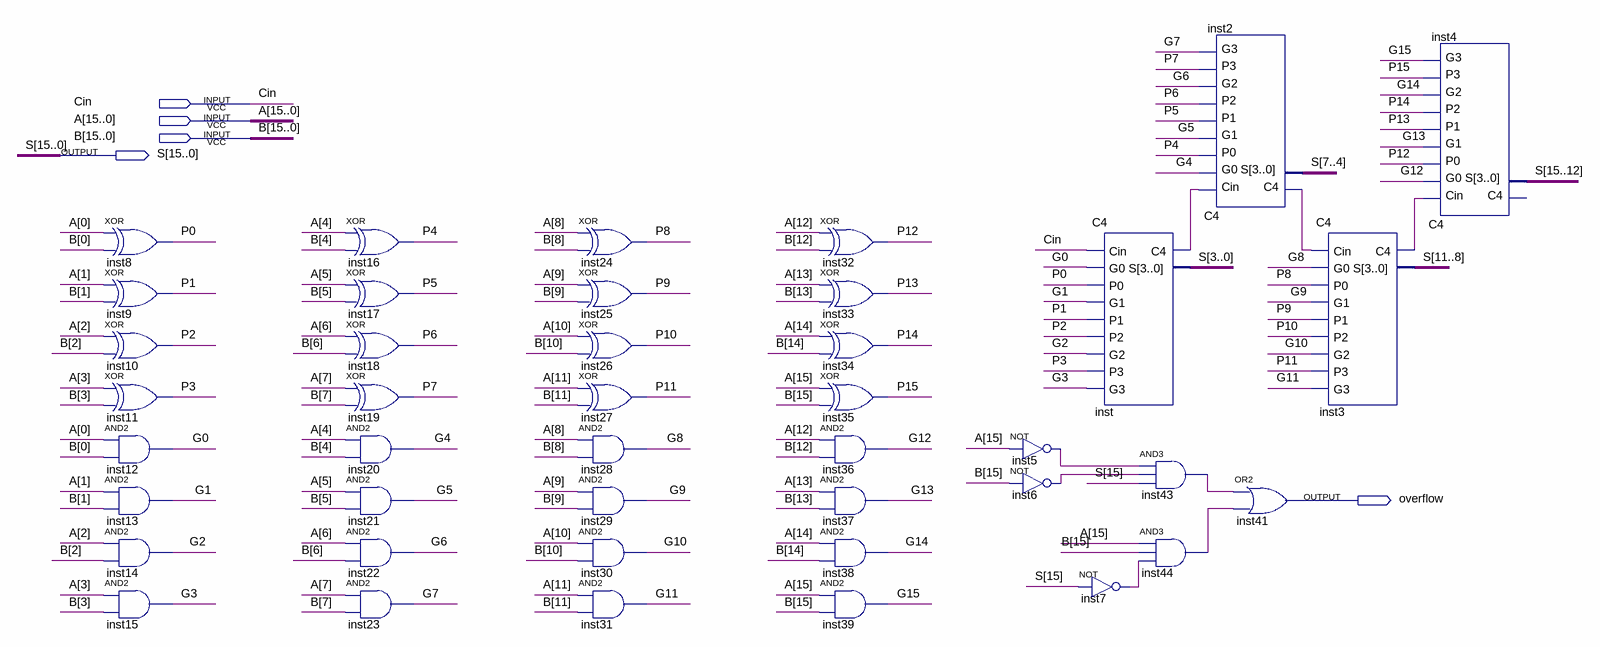
[diagram p0: schematic sheet]
// Quartus schematic CLHA.bdf as structural Verilog: 42 symbols, 5 pins
module CLHA (
  input  Cin,
  input  [15:0] A,
  input  [15:0] B,
  output [15:0] S,
  output overflow
);

  wire G0, G1, G2, G3, G4, G5, G6, G7, G8, G9, G10, G11, G12, G13, G14, G15, inst2_c4, inst3_c4, inst5_out,
       inst6_out, inst7_out, inst43_out, inst44_out, inst_c4, P0, P1, P2, P3, P4, P5, P6, P7, P8, P9, P10,
       P11, P12, P13, P14, P15;

  xor inst8 (P0, A[0], B[0]);
  xor inst9 (P1, A[1], B[1]);
  xor inst10 (P2, A[2], B[2]);
  xor inst11 (P3, A[3], B[3]);
  and inst12 (G0, A[0], B[0]);
  and inst13 (G1, A[1], B[1]);
  and inst14 (G2, A[2], B[2]);
  and inst15 (G3, A[3], B[3]);
  xor inst16 (P4, A[4], B[4]);
  xor inst17 (P5, A[5], B[5]);
  xor inst18 (P6, A[6], B[6]);
  xor inst19 (P7, A[7], B[7]);
  and inst20 (G4, A[4], B[4]);
  and inst21 (G5, A[5], B[5]);
  and inst22 (G6, A[6], B[6]);
  and inst23 (G7, A[7], B[7]);
  xor inst24 (P8, A[8], B[8]);
  xor inst25 (P9, A[9], B[9]);
  xor inst26 (P10, A[10], B[10]);
  xor inst27 (P11, A[11], B[11]);
  and inst28 (G8, A[8], B[8]);
  and inst29 (G9, A[9], B[9]);
  and inst30 (G10, A[10], B[10]);
  and inst31 (G11, A[11], B[11]);
  xor inst32 (P12, A[12], B[12]);
  xor inst33 (P13, A[13], B[13]);
  xor inst34 (P14, A[14], B[14]);
  xor inst35 (P15, A[15], B[15]);
  and inst36 (G12, A[12], B[12]);
  and inst37 (G13, A[13], B[13]);
  and inst38 (G14, A[14], B[14]);
  and inst39 (G15, A[15], B[15]);
  not inst5 (inst5_out, A[15]);
  not inst6 (inst6_out, B[15]);
  C4 inst (.Cin(Cin), .G0(G0), .P0(P0), .G1(G1), .P1(P1), .P2(P2), .G2(G2), .P3(P3), .G3(G3), .C4(inst_c4), .S(S[3:0]));
  not inst7 (inst7_out, S[15]);
  C4 inst2 (
    .Cin(inst_c4), .G0(G4), .P0(P4), .G1(G5), .P1(P5), .P2(P6), .G2(G6), .P3(P7), .G3(G7), .C4(inst2_c4),
    .S(S[7:4]));
  and inst43 (inst43_out, inst5_out, inst6_out, S[15]);
  and inst44 (inst44_out, A[15], B[15], inst7_out);
  or inst41 (overflow, inst43_out, inst44_out);
  C4 inst3 (
    .Cin(inst2_c4), .G0(G8), .P0(P8), .G1(G9), .P1(P9), .P2(P10), .G2(G10), .P3(P11), .G3(G11),
    .C4(inst3_c4), .S(S[11:8]));
  C4 inst4 (
    .Cin(inst3_c4), .G0(G12), .P0(P12), .G1(G13), .P1(P13), .P2(P14), .G2(G14), .P3(P15), .G3(G15),
    .S(S[15:12]));  // open: C4
endmodule
